# Altium schematic sheet ADJ Power managment.SchDoc
size A4; SheetNumber: 8; SheetTotal: 8
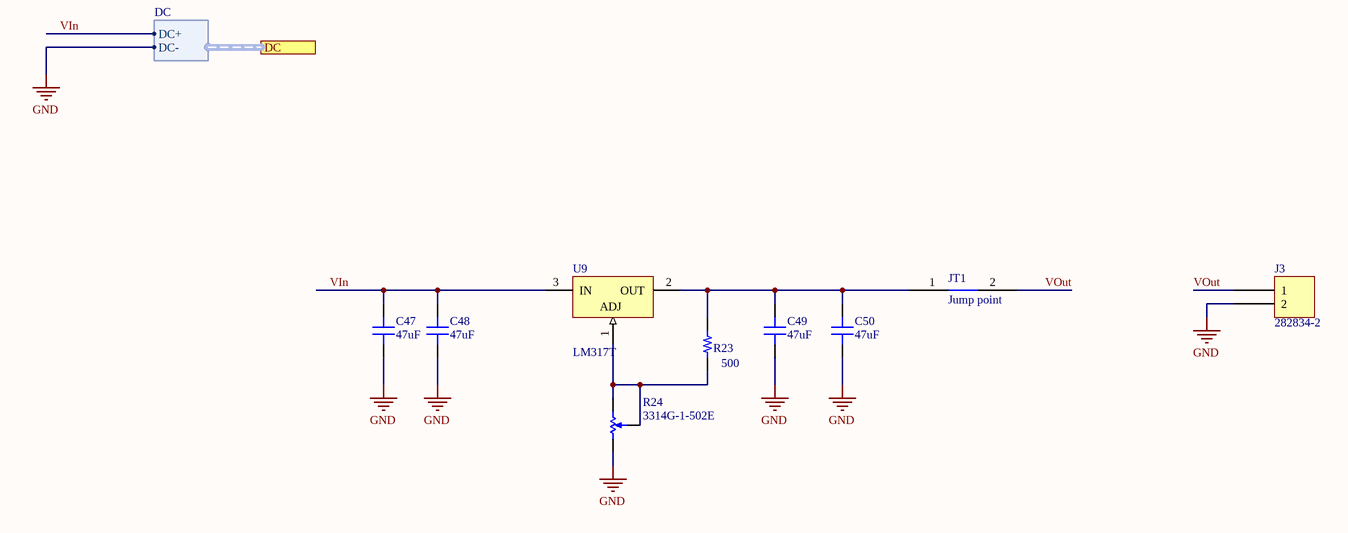
[diagram p0: ADJ Power managment.SchDoc]

## Parts
C47  47uF  [CAP 0805_2012]
C48  47uF  [CAP 0805_2012]
C49  47uF  [CAP 0805_2012]
C50  47uF  [CAP 0805_2012]
J3  282834-2  [TE 282834-2]
JT1  Jump point  [jump poınt]
R23  500  [RES 0805_2012]
R24  3314G-1-502E  [BOUR-3314G-1_V]
U9  LM317T  [NDE0003A]

## Ports
DC (harness DC)

## Harnesses
DC: DC+, DC-

## Nets
GND: C47.1 C48.1 C49.1 C50.1 J3.2 R24.1 ; port DC.DC-
VIn: C47.2 C48.2 U9.3(IN) ; port DC.DC+
VOut: J3.1 JT1.2
NetC49_2: C49.2 C50.2 JT1.1 R23.2 U9.2(OUT)
NetR23_1: R23.1 R24.2 R24.3 U9.1(ADJ)

## Library data of the parts
C47-C50 = CBR08C330JAGAC: CAP CER 33PF 250V C0G/NP0 0805; Manufacturer: KEMET; Temperature Coefficient: C0G, NP0; Tolerance: ±5%; Part Number: CBR08C330JAGAC; Value: 47uF; Applications: RF, Microwave, High Frequency; Capacitance: 33pF; ComponentLink1Description: Datasheet; ComponentLink1URL: https://api.kemet.com/component-edge/download/datasheet/CBR08C330JAGAC.pdf; ComponentLink2Description: DigiKey Link; ComponentLink2URL: http://digikey.com/product-detail/en/kemet/CBR08C330JAGAC/399-6202-1-ND/2732182; Device Package: 0805 (2012 Metric); Features: High Q, Low Loss, Ultra Low ESR; LastUpdated: 2.09.2020 01:04:42; Lifecycle Status: Active; Minimum Order: 1; Mounting Type: Surface Mount, MLCC; Operating Temperature: -55°C ~ 125°C; Package / Case: 0805 (2012 Metric); Packaging: TapeAndReel; PartId: 2409; Part Status: Active; Price: 0.44; Series: CBR-SMD RF C0G; Size / Dimension: 0.079" L x 0.049" W (2.00mm x 1.25mm); Supplier 1: DigiKey; Supplier Part Number 1: 399-6202-1-ND; Thickness (Max): 0.035" (0.88mm); Voltage - Rated: 250V
J3 = 282834-2: TERM BLK 2P SIDE ENT 2.54MM PCB; Manufacturer: TE Connectivity AMP Connectors; Current: 10A; Mating Orientation: Horizontal with Board; Number of Levels: 1; Pitch: 0.100" (2.54mm); Positions Per Level: 2; Voltage: 150V; Wire Gauge: 16-30 AWG; Wire Termination: Screw - Rising Cage Clamp; Part Number: 282834-2; Color: Green; ComponentLink1Description: Datasheet; ComponentLink1URL: https://www.te.com/commerce/DocumentDelivery/DDEController?Action=srchrtrv&DocNm=282834&DocType=Customer+Drawing&DocLang=English; ComponentLink2Description: DigiKey Link; ComponentLink2URL: http://digikey.com/product-detail/en/te-connectivity-amp-connectors/282834-2/A98333-ND/1150135; LastUpdated: 15.01.2020 04:15:38; Lifecycle Status: Active; Minimum Order: 1; Mounting Type: Through Hole; Packaging: Bulk; Part Status: Active; Price: 0.88; Series: Buchanan; Supplier 1: DigiKey; Supplier Part Number 1: A98333-ND
R23 = TLRZ2ATTD: RES 500 OHM JUMPER 0805; Manufacturer: KOA Speer Electronics, Inc.; Part Number: TLRZ2ATTD; ComponentLink1Description: Datasheet; ComponentLink1URL: http://www.koaspeer.com/catimages/Products/TLRZ/TLRZ.pdf; ComponentLink2Description: DigiKey Link; ComponentLink2URL: http://digikey.com/product-detail/en/koa-speer-electronics-inc/TLRZ2ATTD/2019-TLRZ2ATTDCT-ND/9847538; Composition: Metal Element; Device Package: 0805 (2012 Metric); Features: Automotive AEC-Q200, Current Sense; Height - Seated (Max): 0.022" (0.55mm); LastUpdated: 2.09.2020 01:15:24; Lifecycle Status: Active; Minimum Order: 1; Number of Terminations: 2; Operating Temperature: -55°C ~ 170°C; Package / Case: 0805 (2012 Metric); Packaging: TapeAndReel; PartId: 27685; Part Status: Active; Price: 0.09; Ratings: AEC-Q200; Series: TLRZ; Size / Dimension: 0.079" L x 0.049" W (2.00mm x 1.25mm); Supplier 1: DigiKey; Supplier Part Number 1: 2019-TLRZ2ATTDCT-ND; Supplier Device Package: 0805; Tolerance: Jumper
R24 = CMP-2000-05589-1: 4 mm Square Trimpot(R) Trimming Potentiometer, 5 KOhm, +/- 20%, 0.25 W, -55 to 125 degC, 3-Pin SMD, RoHS, Tape and Reel; Manufacturer: Bourns; Power: 250; Angle of rotation: 240°; Dielectric strength: 500; Resistance: 5; Curve: linear; Package Description: 3-Pin Surface Mount Device, Body 4.5 x 4.5 mm, Pitch 1.15 mm; Package Reference: 3314G-1; Mounting Technology: SurfaceMount; Datasheet URL: http://www.bourns.com/docs/Product-Datasheets/3314.pdf; Datasheet Version: 05/2016; Tolerance: ±20%; Manufacturer URL: http://www.bourns.com/; Temperature range: -55...+125°C; Package: GullWing
U9 = CMP-0062-02456-3: 3-Terminal Adjustable Regulator, 3-pin TO-220; Manufacturer: Texas Instruments; CompType: LDO IC; PowerWise: N; PackageTopMarking: NSUZXYTTE#*LM317T P+; ComponentLink1Description: Datasheet URL; PackageReference: NDE0003A; PinCount: 3; ComponentLink1URL: http://www.ti.com/general/docs/lit/getliterature.tsp?genericPartNumber=LM317-N&fileType=pdf; RoHS: N; PackageDescription: TO-220, Molded, 3 Lead, Straight